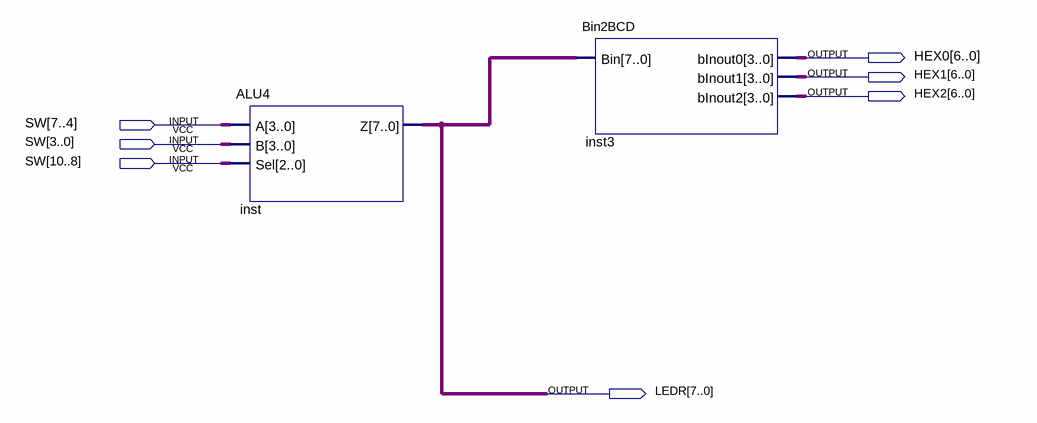
[diagram p0: schematic sheet]
// Quartus schematic ALUDemo.bdf as structural Verilog: 2 symbols, 7 pins
module ALUDemo (
  input  [10:0] SW,
  output [6:0] HEX0,
  output [6:0] HEX1,
  output [6:0] HEX2,
  output [7:0] LEDR
);

  ALU4 inst (.A(SW[7:4]), .B(SW[3:0]), .Sel(SW[10:8]), .Z(LEDR));
  Bin2BCD inst3 (.Bin(LEDR), .bInout0(HEX0), .bInout1(HEX1), .bInout2(HEX2));
endmodule
